# Altium schematic sheet GMSL_DESERIALIZER.SchDoc
size D; SheetNumber: 4; SheetTotal: 24
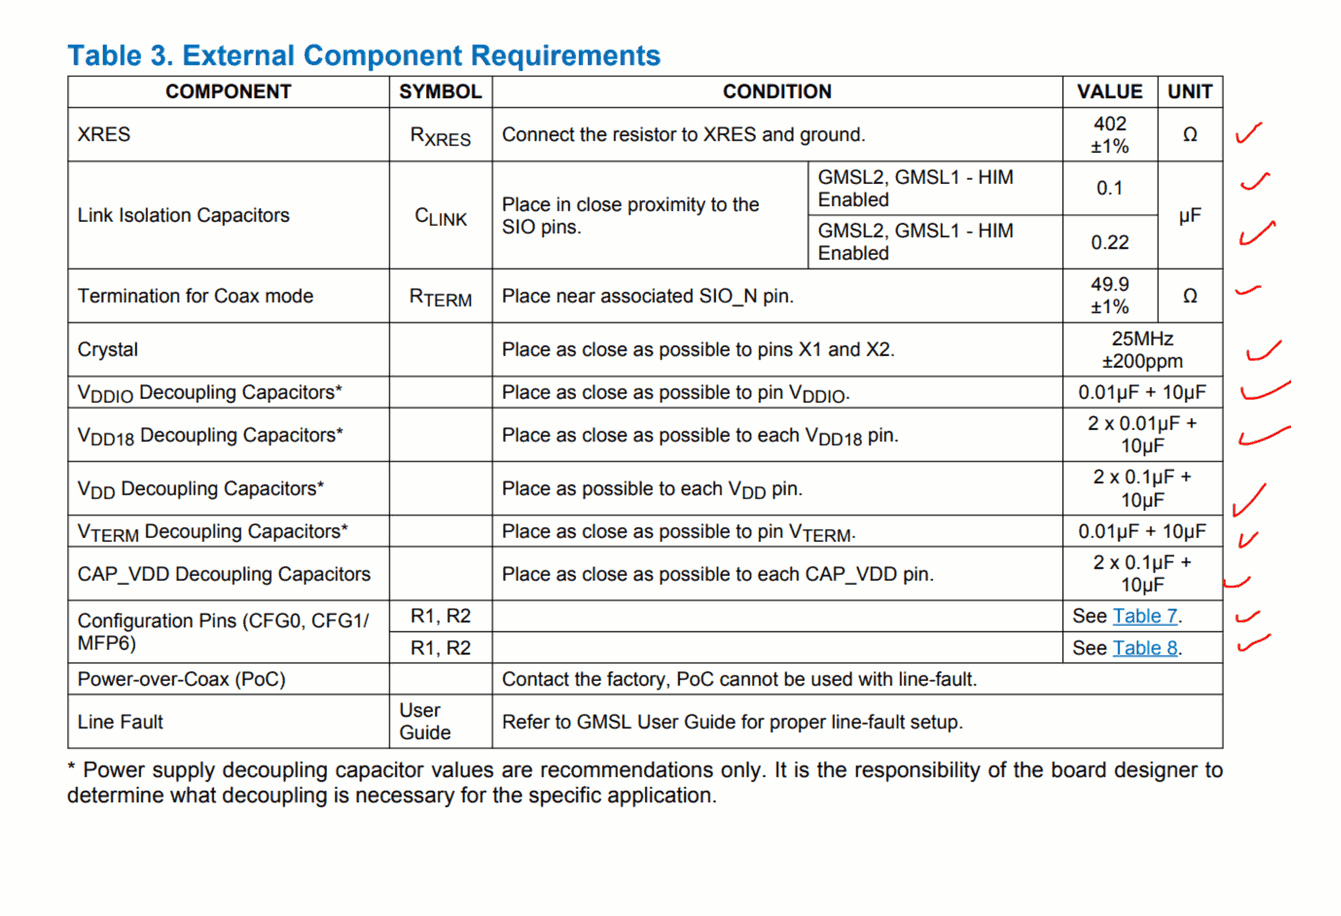
[diagram p0: GMSL_DESERIALIZER.SchDoc, top left]
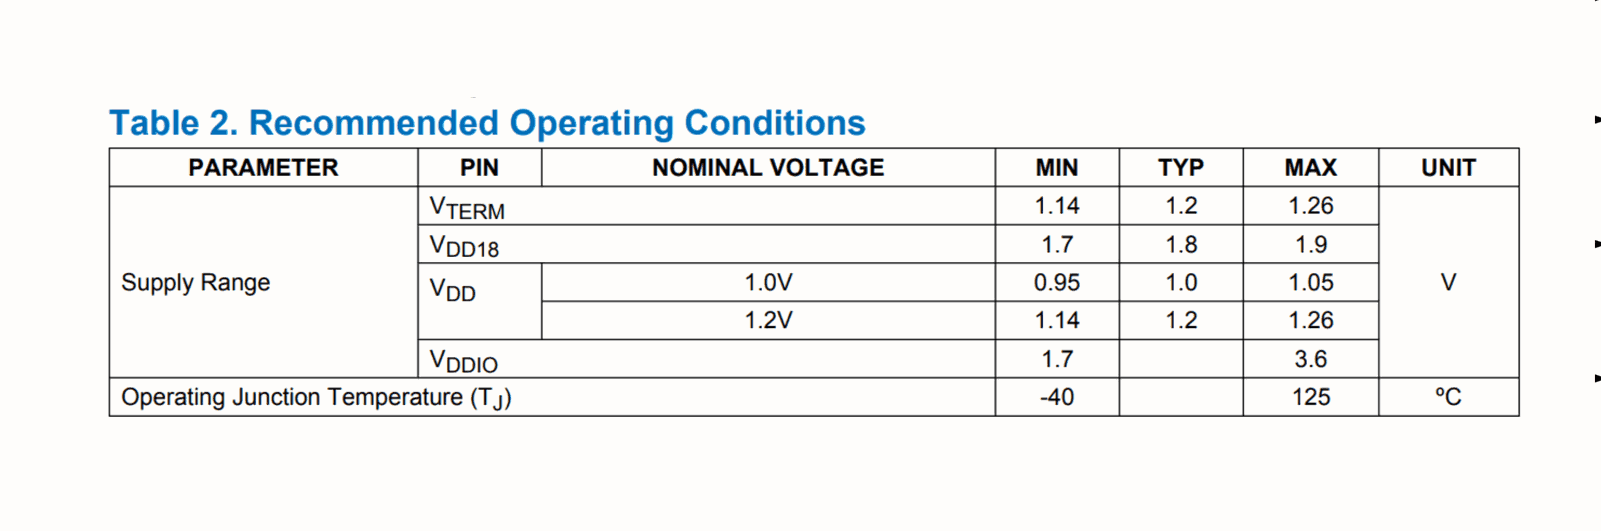
[diagram p1: GMSL_DESERIALIZER.SchDoc, top middle]
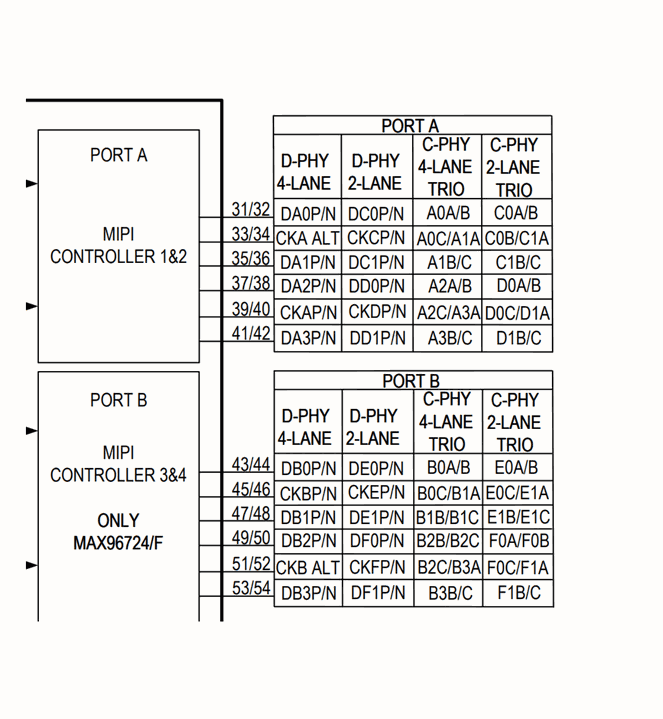
[diagram p2: GMSL_DESERIALIZER.SchDoc, top right]
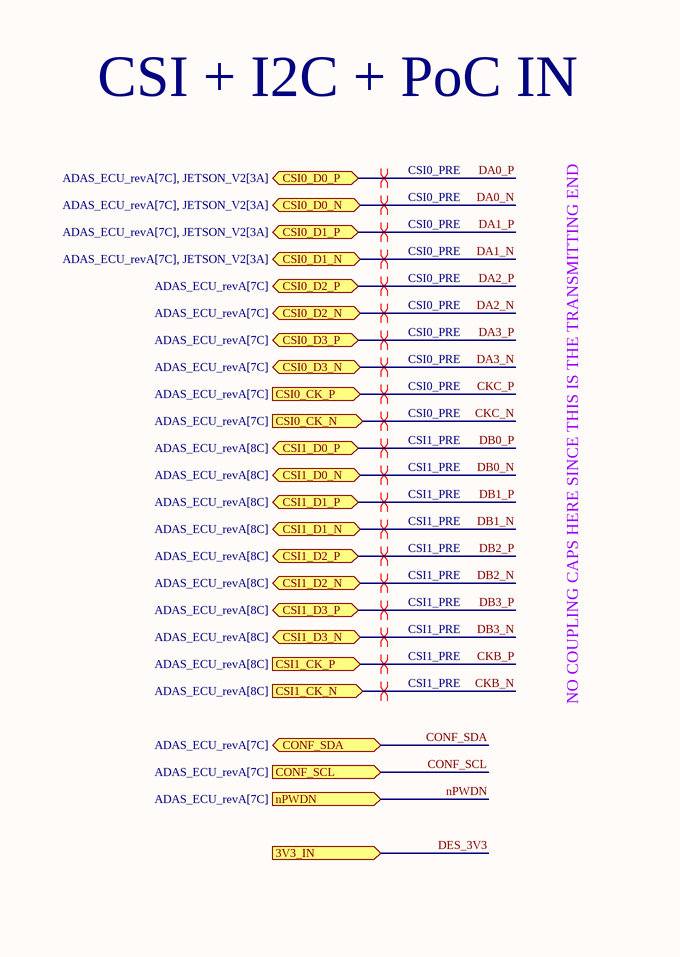
[diagram p3: GMSL_DESERIALIZER.SchDoc, centre left]
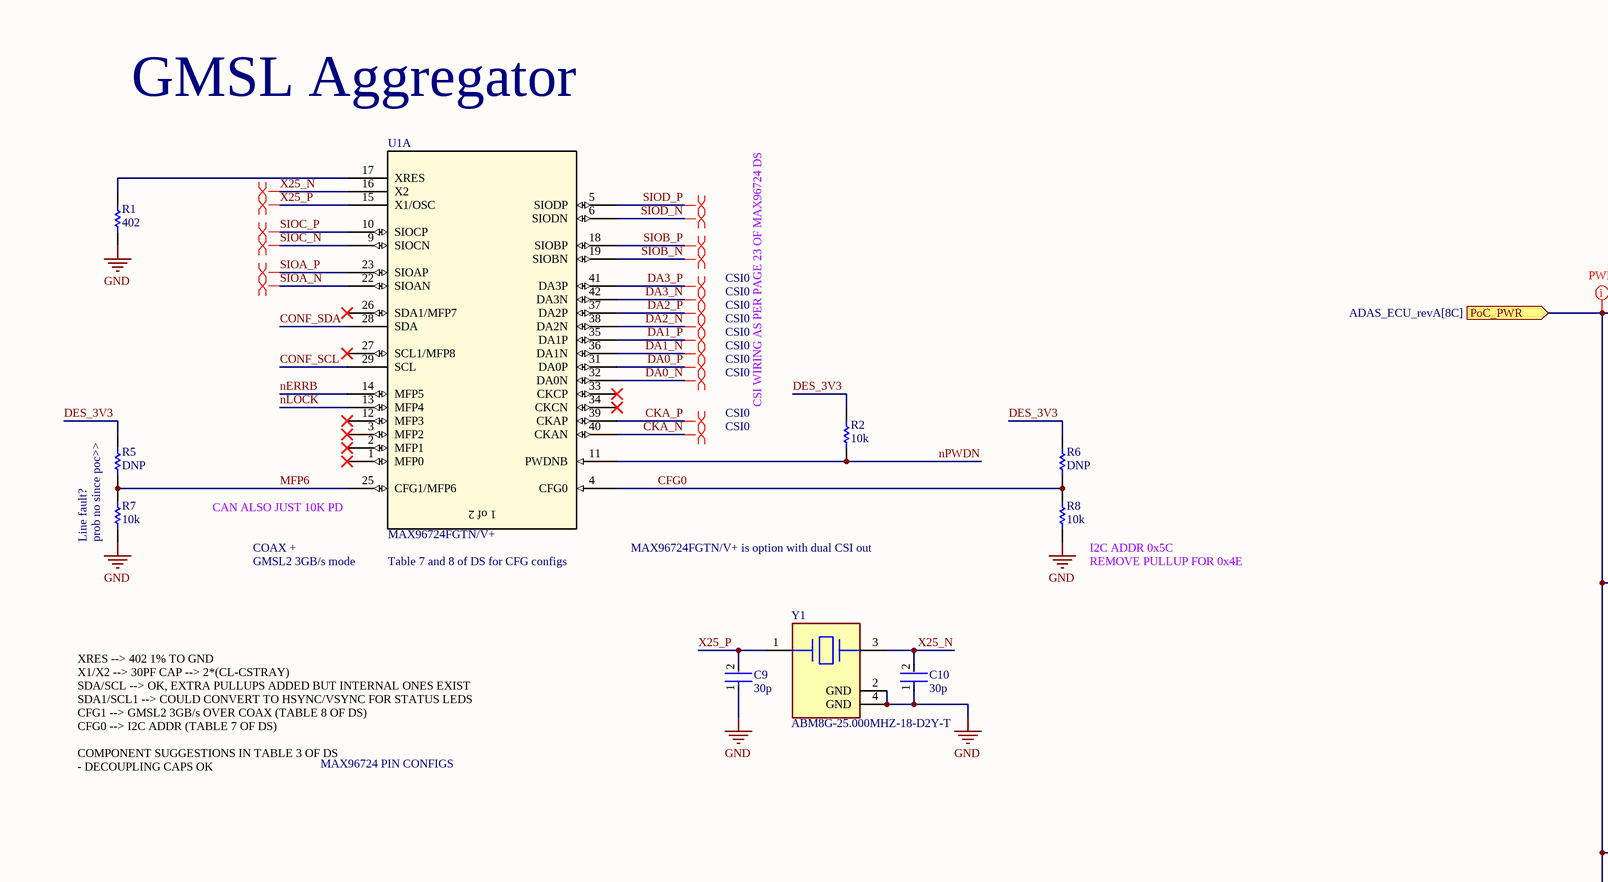
[diagram p4: GMSL_DESERIALIZER.SchDoc, centre middle]
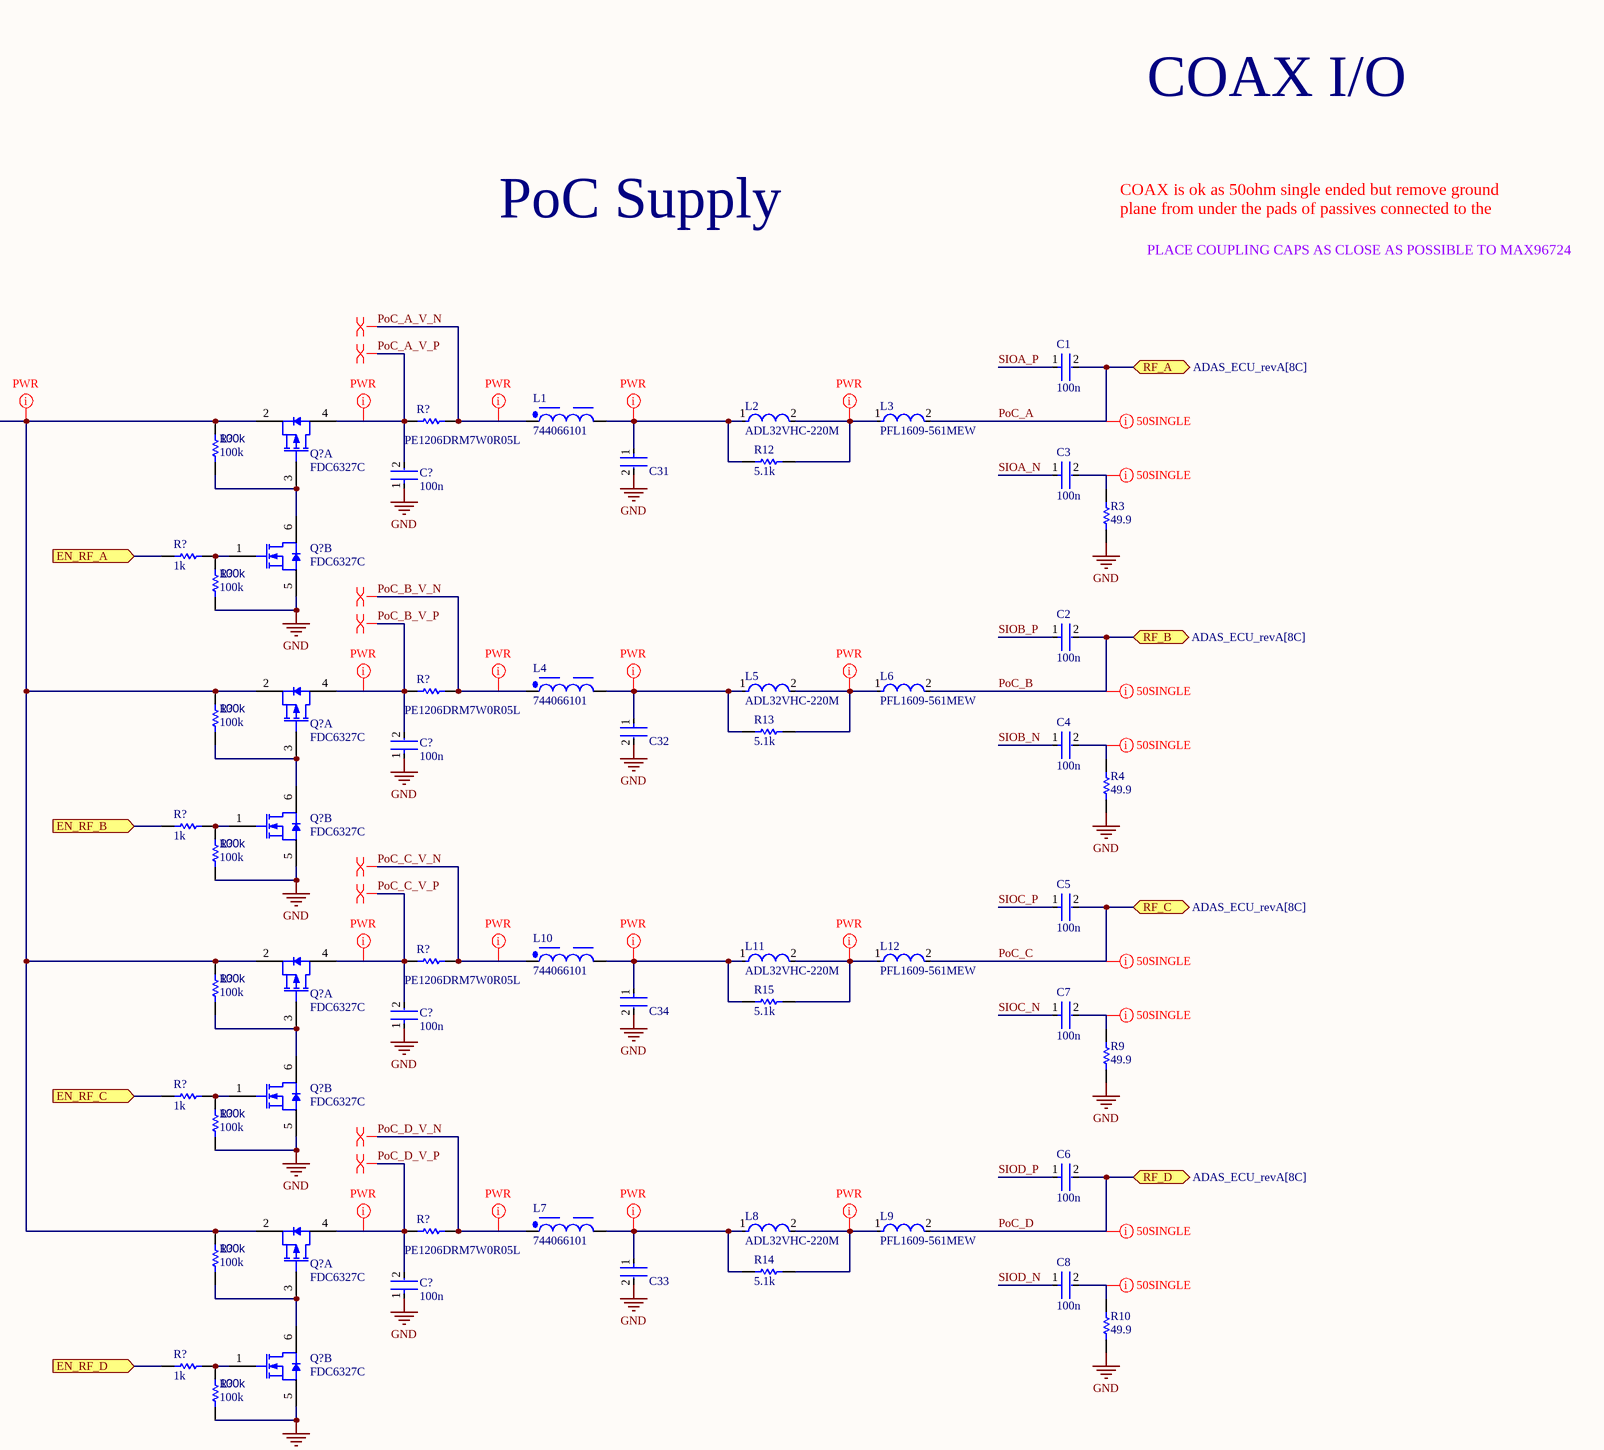
[diagram p5: GMSL_DESERIALIZER.SchDoc, centre right]
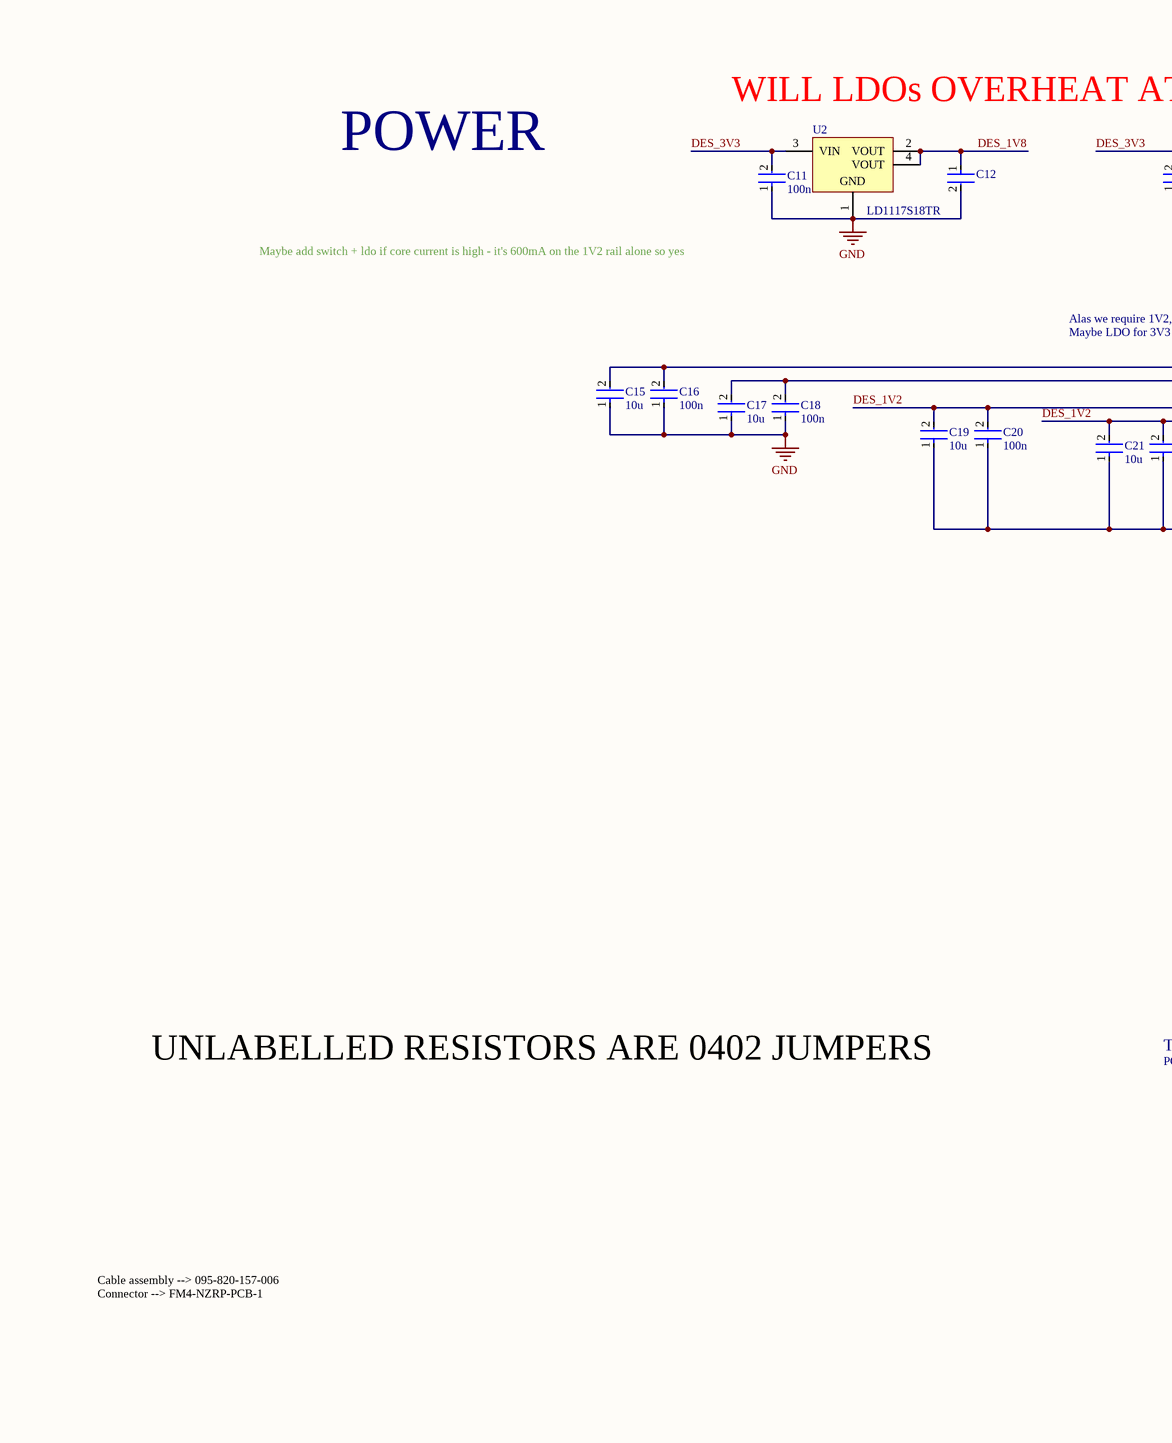
[diagram p6: GMSL_DESERIALIZER.SchDoc, bottom left]
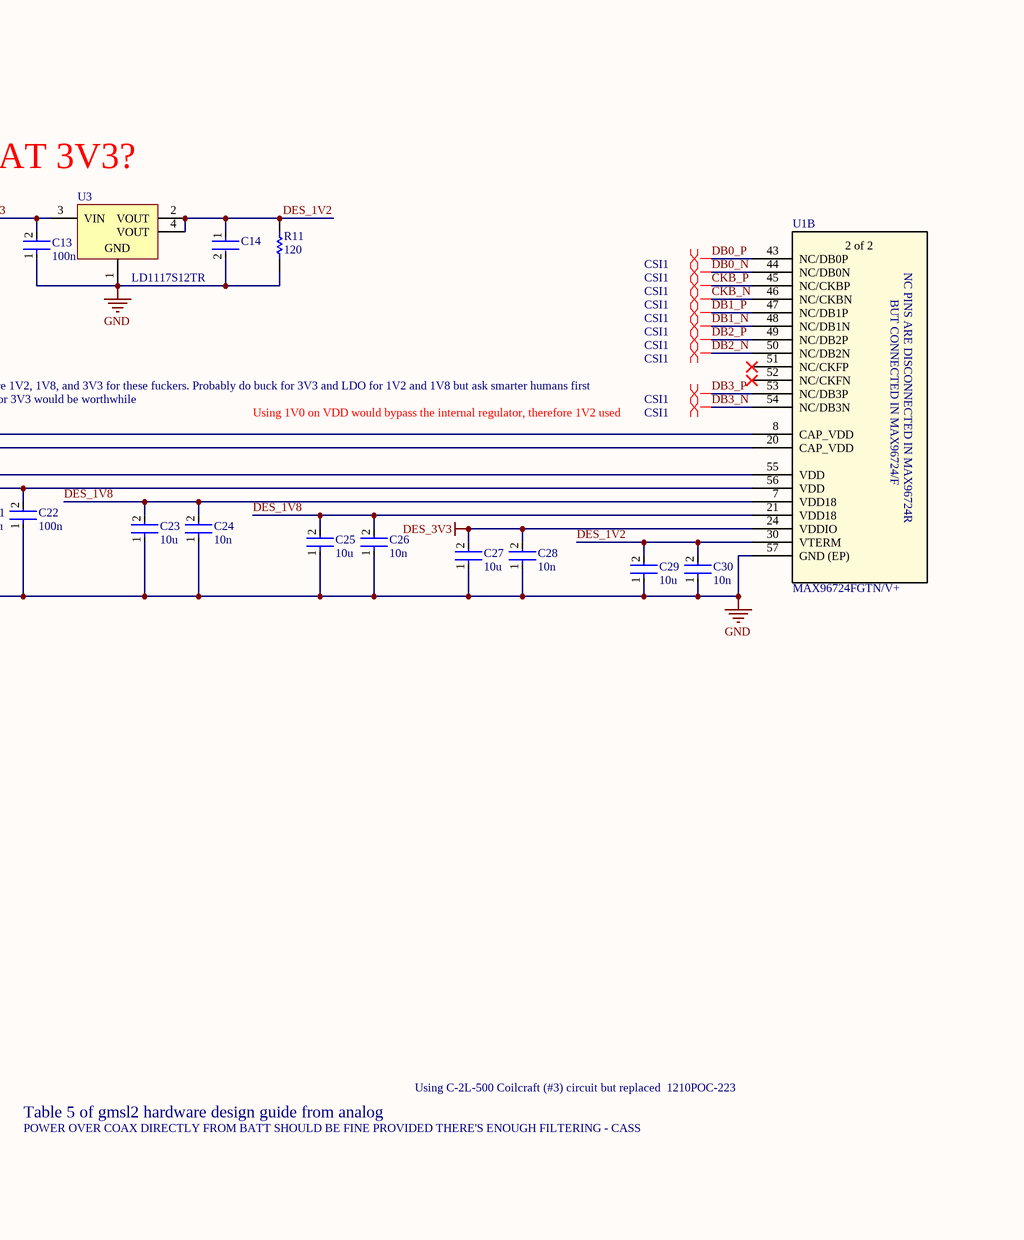
[diagram p7: GMSL_DESERIALIZER.SchDoc, bottom middle]
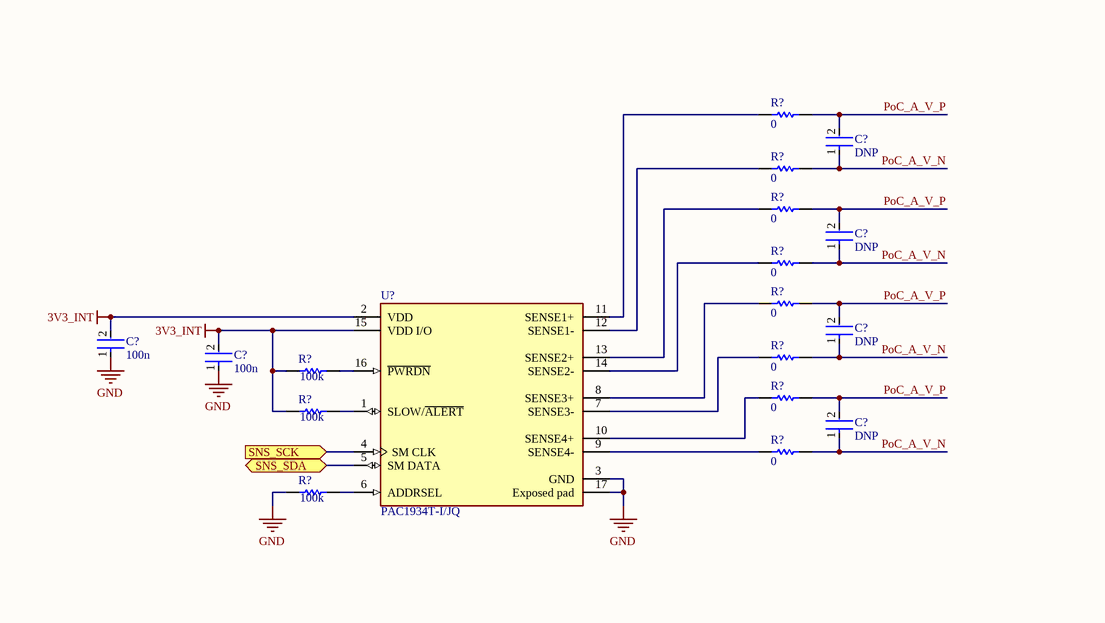
[diagram p8: GMSL_DESERIALIZER.SchDoc, bottom right]

## Parts
(Parts that share a designator on the sheet are numbered #1, #2 ... from top to bottom, then left to right.)
C1  100n  [FP-0402-L_1_0_0_05-W_0_5-IPC_A]
C2  100n  [FP-0402-L_1_0_0_05-W_0_5-IPC_A]
C3  100n  [FP-0402-L_1_0_0_05-W_0_5-IPC_A]
C4  100n  [FP-0402-L_1_0_0_05-W_0_5-IPC_A]
C5  100n  [FP-0402-L_1_0_0_05-W_0_5-IPC_A]
C6  100n  [FP-0402-L_1_0_0_05-W_0_5-IPC_A]
C7  100n  [FP-0402-L_1_0_0_05-W_0_5-IPC_A]
C8  100n  [FP-0402-L_1_0_0_05-W_0_5-IPC_A]
C9  30p  [FP-0402-L_1_0_0_05-W_0_5-IPC_A]
C10  30p  [FP-0402-L_1_0_0_05-W_0_5-IPC_A]
C11  100n  [FP-0402-L_1_0_0_05-W_0_5-IPC_A]
C12  GRM188R60J106ME47D  [FP-GRM188-0_1-e0_2_0_55-IPC_A]  (value not drawn)
C13  100n  [FP-0402-L_1_0_0_05-W_0_5-IPC_A]
C14  GRM188R60J106ME47D  [FP-GRM188-0_1-e0_2_0_55-IPC_A]  (value not drawn)
C15  10u  [FP-0402-L_1_0_0_05-W_0_5-IPC_A]
C16  100n  [FP-0402-L_1_0_0_05-W_0_5-IPC_A]
C17  10u  [FP-0402-L_1_0_0_05-W_0_5-IPC_A]
C18  100n  [FP-0402-L_1_0_0_05-W_0_5-IPC_A]
C19  10u  [FP-0402-L_1_0_0_05-W_0_5-IPC_A]
C20  100n  [FP-0402-L_1_0_0_05-W_0_5-IPC_A]
C21  10u  [FP-0402-L_1_0_0_05-W_0_5-IPC_A]
C22  100n  [FP-0402-L_1_0_0_05-W_0_5-IPC_A]
C23  10u  [FP-0402-L_1_0_0_05-W_0_5-IPC_A]
C24  10n  [FP-0402-L_1_0_0_05-W_0_5-IPC_A]
C25  10u  [FP-0402-L_1_0_0_05-W_0_5-IPC_A]
C26  10n  [FP-0402-L_1_0_0_05-W_0_5-IPC_A]
C27  10u  [FP-0402-L_1_0_0_05-W_0_5-IPC_A]
C28  10n  [FP-0402-L_1_0_0_05-W_0_5-IPC_A]
C29  10u  [FP-0402-L_1_0_0_05-W_0_5-IPC_A]
C30  10n  [FP-0402-L_1_0_0_05-W_0_5-IPC_A]
C31  GRM21BR61E226ME44L  [FP-GRM21B-0_2-e0_2_0_7-IPC_B]  (value not drawn)
C32  GRM21BR61E226ME44L  [FP-GRM21B-0_2-e0_2_0_7-IPC_B]  (value not drawn)
C33  GRM21BR61E226ME44L  [FP-GRM21B-0_2-e0_2_0_7-IPC_B]  (value not drawn)
C34  GRM21BR61E226ME44L  [FP-GRM21B-0_2-e0_2_0_7-IPC_B]  (value not drawn)
C?#1  100n  [FP-0402-L_1_0_0_05-W_0_5-IPC_A]
C?#2  100n  [FP-0402-L_1_0_0_05-W_0_5-IPC_A]
C?#3  100n  [FP-0402-L_1_0_0_05-W_0_5-IPC_A]
C?#4  100n  [FP-0402-L_1_0_0_05-W_0_5-IPC_A]
C?#5  DNP  [FP-0402-L_1_0_0_05-W_0_5-IPC_A]
C?#6  DNP  [FP-0402-L_1_0_0_05-W_0_5-IPC_A]
C?#7  DNP  [FP-0402-L_1_0_0_05-W_0_5-IPC_A]
C?#8  100n  [FP-0402-L_1_0_0_05-W_0_5-IPC_A]
C?#9  100n  [FP-0402-L_1_0_0_05-W_0_5-IPC_A]
C?#10  DNP  [FP-0402-L_1_0_0_05-W_0_5-IPC_A]
L1  744066101  [WE-TPC_1038]
L2  ADL32VHC-220M  [FP-1210POC-MFG]
L3  PFL1609-561MEW  [FP-PFL1609-MFG]
L4  744066101  [WE-TPC_1038]
L5  ADL32VHC-220M  [FP-1210POC-MFG]
L6  PFL1609-561MEW  [FP-PFL1609-MFG]
L7  744066101  [WE-TPC_1038]
L8  ADL32VHC-220M  [FP-1210POC-MFG]
L9  PFL1609-561MEW  [FP-PFL1609-MFG]
L10  744066101  [WE-TPC_1038]
L11  ADL32VHC-220M  [FP-1210POC-MFG]
L12  PFL1609-561MEW  [FP-PFL1609-MFG]
Q?#1  FDC6327C  [FAIR-SOT23-6_V]  (part A of 2)
Q?#2  FDC6327C  [FAIR-SOT23-6_V]  (part B of 2)
Q?#3  FDC6327C  [FAIR-SOT23-6_V]  (part A of 2)
Q?#4  FDC6327C  [FAIR-SOT23-6_V]  (part B of 2)
Q?#5  FDC6327C  [FAIR-SOT23-6_V]  (part A of 2)
Q?#6  FDC6327C  [FAIR-SOT23-6_V]  (part B of 2)
Q?#7  FDC6327C  [FAIR-SOT23-6_V]  (part A of 2)
Q?#8  FDC6327C  [FAIR-SOT23-6_V]  (part B of 2)
R1  402  [R0603B]
R2  10k  [R0603B]
R3  49.9  [R0603B]
R4  49.9  [R0603B]
R5  DNP  [R0603B]
R6  DNP  [R0603B]
R7  10k  [R0603B]
R8  10k  [R0603B]
R9  49.9  [R0603B]
R10  49.9  [R0603B]
R11  120  [R0603B]
R12  5.1k  [R0603B]
R13  5.1k  [R0603B]
R14  5.1k  [R0603B]
R15  5.1k  [R0603B]
R?#1  PE1206DRM7W0R05L  [R1206B]
R?#2  100k  [R0603B]
R?#3  1k  [R0603B]
R?#4  100k  [R0603B]
R?#5  PE1206DRM7W0R05L  [R1206B]
R?#6  100k  [R0603B]
R?#7  1k  [R0603B]
R?#8  100k  [R0603B]
R?#9  PE1206DRM7W0R05L  [R1206B]
R?#10  100k  [R0603B]
R?#11  1k  [R0603B]
R?#12  100k  [R0603B]
R?#13  PE1206DRM7W0R05L  [R1206B]
R?#14  100k  [R0603B]
R?#15  1k  [R0603B]
R?#16  100k  [R0603B]
R?#17  0  [R0603B]
R?#18  0  [R0603B]
R?#19  0  [R0603B]
R?#20  0  [R0603B]
R?#21  0  [R0603B]
R?#22  0  [R0603B]
R?#23  100k  [R0603B]
R?#24  0  [R0603B]
R?#25  100k  [R0603B]
R?#26  0  [R0603B]
R?#27  100k  [R0603B]
U1  MAX96724FGTN/V+  [MAX96724FGTN_V+-Footprint-1]  (parts A,B of 2)
U2  LD1117S18TR  [SOT-223_M]
U3  LD1117S12TR  [SOT-223_M]
U?  PAC1934T-I/JQ  [FP-C04-257-MFG]
Y1  ABM8G-25.000MHZ-18-D2Y-T  [FP-ABM8G-MFG]

## Ports
3V3_IN (in), CONF_SCL (in, see ADAS_ECU_revA[7C]), CONF_SDA (bidir, see ADAS_ECU_revA[7C]), CSI0_CK_N (in, see ADAS_ECU_revA[7C]), CSI0_CK_P (in, see ADAS_ECU_revA[7C]), CSI0_D0_N (bidir, see ADAS_ECU_revA[7C], JETSON_V2[3A]), CSI0_D0_P (bidir, see ADAS_ECU_revA[7C], JETSON_V2[3A]), CSI0_D1_N (bidir, see ADAS_ECU_revA[7C], JETSON_V2[3A]), CSI0_D1_P (bidir, see ADAS_ECU_revA[7C], JETSON_V2[3A]), CSI0_D2_N (bidir, see ADAS_ECU_revA[7C]), CSI0_D2_P (bidir, see ADAS_ECU_revA[7C]), CSI0_D3_N (bidir, see ADAS_ECU_revA[7C]), CSI0_D3_P (bidir, see ADAS_ECU_revA[7C]), CSI1_CK_N (in, see ADAS_ECU_revA[8C]), CSI1_CK_P (in, see ADAS_ECU_revA[8C]), CSI1_D0_N (bidir, see ADAS_ECU_revA[8C]), CSI1_D0_P (bidir, see ADAS_ECU_revA[8C]), CSI1_D1_N (bidir, see ADAS_ECU_revA[8C]), CSI1_D1_P (bidir, see ADAS_ECU_revA[8C]), CSI1_D2_N (bidir, see ADAS_ECU_revA[8C]), CSI1_D2_P (bidir, see ADAS_ECU_revA[8C]), CSI1_D3_N (bidir, see ADAS_ECU_revA[8C]), CSI1_D3_P (bidir, see ADAS_ECU_revA[8C]), EN_RF_A (in), EN_RF_B (in), EN_RF_C (in), EN_RF_D (in), nPWDN (in, see ADAS_ECU_revA[7C]), PoC_PWR (in, see ADAS_ECU_revA[8C]), RF_A (bidir, see ADAS_ECU_revA[8C]), RF_B (bidir, see ADAS_ECU_revA[8C]), RF_C (bidir, see ADAS_ECU_revA[8C]), RF_D (bidir, see ADAS_ECU_revA[8C]), SNS_SCK (in), SNS_SDA (bidir)

## Nets
3V3_INT: C?#8.2 C?#9.2 R?#23.2 R?#25.2 U?.2(VDD) U?.15(VDD_I/O)
DES_3V3: C11.2 C13.2 C27.2 C28.2 R2.2 R5.2 R6.2 U1.24(VDDIO) U2.3(VIN) U3.3(VIN) ; port 3V3_IN
GND: C9.1 C10.1 C11.1 C12.2 C13.1 C14.2 C15.1 C16.1 C17.1 C18.1 C19.1 C20.1 C21.1 C22.1 C23.1 C24.1 C25.1 C26.1 C27.1 C28.1 C29.1 C30.1 C31.2 C32.2 C33.2 C34.2 C?#1.1 C?#2.1 C?#3.1 C?#4.1 C?#8.1 C?#9.1 Q?#2.5(S) Q?#4.5(S) Q?#6.5(S) Q?#8.5(S) R1.1 R3.1 R4.1 R7.1 R8.1 R9.1 R10.1 R11.1 R?#4.1 R?#8.1 R?#12.1 R?#16.1 R?#27.2 U1.57(GND_(EP)) U2.1(GND) U3.1(GND) U?.3(GND) U?.17(Exposed_pad) Y1.2(GND) Y1.4(GND)
CFG0: R6.1 R8.2 U1.4(CFG0)
CKA_N: U1.40(CKAN)
CKA_P: U1.39(CKAP)
CKB_N: U1.46(NC/CKBN) ; port CSI1_CK_N
CKB_P: U1.45(NC/CKBP) ; port CSI1_CK_P
CKC_N: port CSI0_CK_N
CKC_P: port CSI0_CK_P
CONF_SCL: U1.29(SCL) ; port CONF_SCL
CONF_SDA: U1.28(SDA) ; port CONF_SDA
DA0_N: U1.32(DA0N) ; port CSI0_D0_N
DA0_P: U1.31(DA0P) ; port CSI0_D0_P
DA1_N: U1.36(DA1N) ; port CSI0_D1_N
DA1_P: U1.35(DA1P) ; port CSI0_D1_P
DA2_N: U1.38(DA2N) ; port CSI0_D2_N
DA2_P: U1.37(DA2P) ; port CSI0_D2_P
DA3_N: U1.42(DA3N) ; port CSI0_D3_N
DA3_P: U1.41(DA3P) ; port CSI0_D3_P
DB0_N: U1.44(NC/DB0N) ; port CSI1_D0_N
DB0_P: U1.43(NC/DB0P) ; port CSI1_D0_P
DB1_N: U1.48(NC/DB1N) ; port CSI1_D1_N
DB1_P: U1.47(NC/DB1P) ; port CSI1_D1_P
DB2_N: U1.50(NC/DB2N) ; port CSI1_D2_N
DB2_P: U1.49(NC/DB2P) ; port CSI1_D2_P
DB3_N: U1.54(NC/DB3N) ; port CSI1_D3_N
DB3_P: U1.53(NC/DB3P) ; port CSI1_D3_P
DES_1V2: C14.1 C19.2 C20.2 C21.2 C22.2 C29.2 C30.2 R11.2 U1.30(VTERM) U1.55(VDD) U1.56(VDD) U3.2(VOUT) U3.4(VOUT)
DES_1V8: C12.1 C23.2 C24.2 C25.2 C26.2 U1.7(VDD18) U1.21(VDD18) U2.2(VOUT) U2.4(VOUT)
EN_RF_A: R?#3.2 ; port EN_RF_A
EN_RF_B: R?#7.2 ; port EN_RF_B
EN_RF_C: R?#11.2 ; port EN_RF_C
EN_RF_D: R?#15.2 ; port EN_RF_D
MFP6: R5.1 R7.2 U1.25(CFG1/MFP6)
nERRB: U1.14(MFP5)
nLOCK: U1.13(MFP4)
nPWDN: R2.1 U1.11(PWDNB) ; port nPWDN
PoC_A: C1.2 L3.2 ; port RF_A
PoC_A_V_N: C?#5.1 C?#6.1 C?#7.1 C?#10.1 L1.1 R?#1.1 R?#18.1 R?#20.1 R?#22.1 R?#26.1
PoC_A_V_P: C?#1.2 C?#5.2 C?#6.2 C?#7.2 C?#10.2 Q?#1.4(D) R?#1.2 R?#17.1 R?#19.1 R?#21.1 R?#24.1
PoC_B: C2.2 L6.2 ; port RF_B
PoC_B_V_N: L4.1 R?#5.1
PoC_B_V_P: C?#2.2 Q?#3.4(D) R?#5.2
PoC_C: C5.2 L12.2 ; port RF_C
PoC_C_V_N: L10.1 R?#9.1
PoC_C_V_P: C?#3.2 Q?#5.4(D) R?#9.2
PoC_D: C6.2 L9.2 ; port RF_D
PoC_D_V_N: L7.1 R?#13.1
PoC_D_V_P: C?#4.2 Q?#7.4(D) R?#13.2
PoC_PWR: Q?#1.2(S) Q?#3.2(S) Q?#5.2(S) Q?#7.2(S) R?#2.2 R?#6.2 R?#10.2 R?#14.2 ; port PoC_PWR
SIOA_N: C3.1 U1.22(SIOAN)
SIOA_P: C1.1 U1.23(SIOAP)
SIOB_N: C4.1 U1.19(SIOBN)
SIOB_P: C2.1 U1.18(SIOBP)
SIOC_N: C7.1 U1.9(SIOCN)
SIOC_P: C5.1 U1.10(SIOCP)
SIOD_N: C8.1 U1.6(SIODN)
SIOD_P: C6.1 U1.5(SIODP)
SNS_SCK: U?.4(SM_CLK) ; port SNS_SCK
SNS_SDA: U?.5(SM_DATA) ; port SNS_SDA
X25_N: C10.2 U1.16(X2) Y1.3
X25_P: C9.2 U1.15(X1/OSC) Y1.1
NetC3_2: C3.2 R3.2
NetC4_2: C4.2 R4.2
NetC7_2: C7.2 R9.2
NetC8_2: C8.2 R10.2
NetC15_2: C15.2 C16.2 U1.8(CAP_VDD)
NetC17_2: C17.2 C18.2 U1.20(CAP_VDD)
NetC31_1: C31.1 L1.2 L2.1 R12.2
NetC32_1: C32.1 L4.2 L5.1 R13.2
NetC33_1: C33.1 L7.2 L8.1 R14.2
NetC34_1: C34.1 L10.2 L11.1 R15.2
NetL2_2: L2.2 L3.1 R12.1
NetL5_2: L5.2 L6.1 R13.1
NetL8_2: L8.2 L9.1 R14.1
NetL11_2: L11.2 L12.1 R15.1
NetQ?#1_3: Q?#1.3(G) Q?#2.6(D) R?#2.1
NetQ?#2_1: Q?#2.1(G) R?#3.1 R?#4.2
NetQ?#3_3: Q?#3.3(G) Q?#4.6(D) R?#6.1
NetQ?#4_1: Q?#4.1(G) R?#7.1 R?#8.2
NetQ?#5_3: Q?#5.3(G) Q?#6.6(D) R?#10.1
NetQ?#6_1: Q?#6.1(G) R?#11.1 R?#12.2
NetQ?#7_3: Q?#7.3(G) Q?#8.6(D) R?#14.1
NetQ?#8_1: Q?#8.1(G) R?#15.1 R?#16.2
NetR1_2: R1.2 U1.17(XRES)
NetR?#17_2: R?#17.2 U?.11(SENSE1+)
NetR?#18_2: R?#18.2 U?.12(SENSE1-)
NetR?#19_2: R?#19.2 U?.13(SENSE2+)
NetR?#20_2: R?#20.2 U?.14(SENSE2-)
NetR?#21_2: R?#21.2 U?.8(SENSE3+)
NetR?#22_2: R?#22.2 U?.7(SENSE3-)
NetR?#23_1: R?#23.1 U?.16(~{PWRDN})
NetR?#24_2: R?#24.2 U?.10(SENSE4+)
NetR?#25_1: R?#25.1 U?.1(SLOW/~{ALERT})
NetR?#26_2: R?#26.2 U?.9(SENSE4-)
NetR?#27_1: R?#27.1 U?.6(ADDRSEL)

Not connected (* = marked no-connect by the designer): U1 1(MFP0)* 2(MFP1)* 3(MFP2)* 12(MFP3)* 26(SDA1/MFP7)* 27(SCL1/MFP8)* 33(CKCP)* 34(CKCN)* 51(NC/CKFP)* 52(NC/CKFN)*

## Layout directives
differential pair; differential pair class CSI0: CKA_N, CKA_P, DA0_N, DA0_P, DA1_N, DA1_P, DA2_N, DA2_P, DA3_N, DA3_P
differential pair; differential pair class 100DIFF: SIOA_N, SIOA_P, SIOB_N, SIOB_P, SIOC_N, SIOC_P, SIOD_N, SIOD_P
differential pair: PoC_A_V_N, PoC_A_V_P, PoC_B_V_N, PoC_B_V_P, PoC_C_V_N, PoC_C_V_P, PoC_D_V_N, PoC_D_V_P, X25_N, X25_P
differential pair; differential pair class CSI1: CKB_N, CKB_P, DB0_N, DB0_P, DB1_N, DB1_P, DB2_N, DB2_P, DB3_N, DB3_P
differential pair; differential pair class CSI0_PRE: CKC_N, CKC_P, DA0_N, DA0_P, DA1_N, DA1_P, DA2_N, DA2_P, DA3_N, DA3_P
differential pair; differential pair class CSI1_PRE: CKB_N, CKB_P, DB0_N, DB0_P, DB1_N, DB1_P, DB2_N, DB2_P, DB3_N, DB3_P
net class 50SINGLE: NetC3_2, NetC4_2, NetC7_2, NetC8_2, PoC_A, PoC_B, PoC_C, PoC_D
net class PWR: NetC31_1, NetC32_1, NetC33_1, NetC34_1, NetL2_2, NetL5_2, NetL8_2, NetL11_2, PoC_A_V_N, PoC_A_V_P, PoC_B_V_N, PoC_B_V_P, PoC_C_V_N, PoC_C_V_P, PoC_D_V_N, PoC_D_V_P, PoC_PWR

## Notes on the sheet
- COAX I/O
- CSI + I2C + PoC IN
- GMSL Aggregator
- PoC Supply
- COAX is ok as 50ohm single ended but remove ground plane from under the pads of passives connected to the GMSL trace
- PLACE COUPLING CAPS AS CLOSE AS POSSIBLE TO MAX96724
- CSI WIRING AS PER PAGE 23 OF MAX96724 DS
- Line fault?
- prob no since poc>>
- CAN ALSO JUST 10K PD
- GMSL2 3GB/s mode
- COAX +
- Table 7 and 8 of DS for CFG configs
- MAX96724FGTN/V+ is option with dual CSI out
- (near R8) I2C ADDR 0x5C
- (near R8) REMOVE PULLUP FOR 0x4E
- NO COUPLING CAPS HERE SINCE THIS IS THE TRANSMITTING END
- XRES --> 402 1% TO GND
  X1/X2 --> 30PF CAP --> 2*(CL-CSTRAY)
  SDA/SCL --> OK, EXTRA PULLUPS ADDED BUT INTERNAL ONES EXIST
  SDA1/SCL1 --> COULD CONVERT TO HSYNC/VSYNC FOR STATUS LEDS
  CFG1 --> GMSL2 3GB/s OVER COAX (TABLE 8 OF DS)
  CFG0 --> I2C ADDR (TABLE 7 OF DS)
  COMPONENT SUGGESTIONS IN TABLE 3 OF DS
  - DECOUPLING CAPS OK
- MAX96724 PIN CONFIGS
- WILL LDOs OVERHEAT AT 3V3?
- POWER
- Maybe add switch + ldo if core current is high - it's 600mA on the 1V2 rail alone so yes
- Alas we require 1V2, 1V8, and 3V3 for these fuckers. Probably do buck for 3V3 and LDO for 1V2 and 1V8 but ask smarter humans first
- Maybe LDO for 3V3 would be worthwhile
- Using 1V0 on VDD would bypass the internal regulator, therefore 1V2 used
- Using C-2L-500 Coilcraft (#3) circuit but replaced  1210POC-223
- UNLABELLED RESISTORS ARE 0402 JUMPERS
- Table 5 of gmsl2 hardware design guide from analog
- POWER OVER COAX DIRECTLY FROM BATT SHOULD BE FINE PROVIDED THERE'S ENOUGH FILTERING - CASS
- Cable assembly --> 095-820-157-006
  Connector --> FM4-NZRP-PCB-1
- (in symbol CMP-015-00011-2, part A) 1 of 2
- (in symbol CMP-015-00011-2, part B) 2 of 2; NC PINS ARE DISCONNECTED IN MAX96724R; BUT CONNECTED IN MAX96724/F

## Library data of the parts
C1-C11 C13 C15-C30 C?#1-C?#10 = CMP-001-00058-1: LARGE PADS, 0402 CAP, CHANGE COMMENT TO MATCH REAL P/N; Capacitor Type: Ceramic; Min Operating Temperature: -55°C; Mounting Technology: Surface Mount; Pins: 2; Case/Package: 0402; RoHS Compliant: Yes; Max Operating Temperature: 85°C
C12 C14 = CMP-2006-02792-2: Chip Multilayer Ceramic Capacitors for General Purpose, 0603, 10uF, X5R, 15%, 20%, 6.3V; Packaging: Tape and Reel; Voltage Rating (DC): 6.3V; Width: 0.031inch; Termination: SMD/SMT; Dielectric: X5R; Package Quantity: 4000; Voltage Rating: 6.3V; Capacitance: 10uF; Case/Package: 0603; Min Operating Temperature: -55°C; Voltage: 6.3V; Length: 1.6mm; Thickness: 0.035inch; Lead Free: Lead Free; Depth: 0.8mm; Case Code (Imperial): 0603; Max Operating Temperature: 85°C; Material: Ceramic; Height: 0.8mm; Tolerance: 20%; Mount: Surface Mount; REACH SVHC: No SVHC; Radiation Hardening: No; Case Code (Metric): 1608
C31-C34 = CMP-2007-03222-3: Chip Multilayer Ceramic Capacitors for General Purpose, 0805, 22uF, X5R, 15%, 20%, 25V; Case/Package: 0805; Depth: 1.25mm; Resistor Type: Ceramic; Voltage Rating: 25V; Lead Free: Lead Free; Voltage Rating (DC): 25V; Case Code (Metric): 2012; Thickness: 0.057inch; REACH SVHC: No SVHC; Material: Ceramic; Tolerance: 20%; Length: 2mm; Capacitance: 22uF; Case Code (Imperial): 0805; Max Operating Temperature: 85°C; Termination: SMD/SMT; Weight: 0.000335oz; Dielectric: X5R; Packaging: Tape and Reel; Voltage: 25V; Package Quantity: 3000; Height: 1.25mm; Mount: Surface Mount; Width: 1.25mm; Min Operating Temperature: -55°C
L1 L4 L7 L10 = CMP-0227-00094-3: NexarPartId: 8917123; Current Rating: 1.2A; Shielding: Shielded; Core Material: Ferrite; Inductance: 100µH; Test Frequency: 100kHz; Tolerance: 30%; Resistance: 255mΩ; Self Resonant Frequency: 6MHz; Composition: Wirewound; Packaging: Cut Tape (CT); REACH SVHC: Unknown; Number of Pins: 2; Max DC Current: 1.2A; Saturation Current: 1.2A; Ambient Temperature Range High: 95°C; Weight: 1.273007g; Height: 3.8mm; Width: 10mm; Min Operating Temperature: -40°C; Max Operating Temperature: 125°C; Termination: SMD/SMT; Height - Seated (Max): 4.0894mm; Length: 10mm; RMS Current (Irms): 1.2A; Ambient Temperature Range Low: -40°C; RoHS: Compliant; Mount: Surface Mount; Depth: 10mm; DC Resistance (DCR): 255mΩ; Inductance Tolerance: 30%; Case/Package: Nonstandard
L2 L5 L8 L11 = CMP-11268-000041-1: NOT COILCRAFT - ACTUAL P# --> ADL32VHC-220M / - Power Injection Chokes for PoC; Manufacturer Part Number: 1210POC-223MRC; Value: 22uH; Core Material: Ferrite; Saturation Current: 720mA; Series Resistance: 0.88Ω; Rms Current: 700mA; Automotive Grade: Grade 1; Self Resonant Frequency: 70MHz; Test Frequency: 100kHz; Tolerance: 20%; Ambient Temperature Range High: +125°C; Manufacturer: coilcraft; Octopart: https://octopart.com/1210poc-223mrc-coilcraft-103207315; Category: Ind; Device Class L2: Inductors; RoHS: TRUE; Device Class L3: Fixed Inductors; Package: 1210POC; Ambient Temperature Range Low: -40°C; ComponentLink2URL: https://drive.google.com/open?id=15FlOq8Y4YbRFohfA_cJ40jgnqs8va2Mh; Lead Free: Yes; Inductance: 22uH; Device Class L1: Passive Components; ComponentLink2Description: Datasheet; Automotive: Yes; Height: 3mm
L3 L6 L9 L12 = CMP-11268-000007-1: Fixed Inductors PFL1609 Low Profile 0.56 uH 20 % 1.4 A; Manufacturer: coilcraft; Rms Current: 1100mA; Self Resonant Frequency: 600MHz; Core Material: Composite; Tolerance: 20%; Value: 0.56uH; Automotive Grade: Grade 1; Saturation Current: 710mA; Test Frequency: 7.9MHz; Shielding: true; Series Resistance: 130mΩ; Lead Free: Yes; Device Class L1: Passive Components; Package: PFL1609; Octopart: https://octopart.com/pfl1609-561mew-coilcraft-20329171; ComponentLink2URL: https://www.coilcraft.com/pdfs/pfl1609.pdf; Manufacturer Part Number: PFL1609-561MEW; Ambient Temperature Range Low: -40°C; Composition: Wirewound; Inductance: 0.56uH; Device Class L2: Inductors; Category: Ind; Device Class L3: Fixed Inductors; Mouser Description: Fixed Inductors PFL1609 Low Profile 0.56 uH 20 % 1.4 A; Automotive: Yes; ComponentLink2Description: Datasheet; Ambient Temperature Range High: +105°C; Height: 0.95mm; RoHS: TRUE
Q?#1-Q?#8 = CMP-2000-04939-1: Dual N & P-Channel 2.5 V Specified PowerTrench(TM) MOSFET, -55 to 150 degC, 6-Pin SOT-23, RoHS, Tape and Reel; Manufacturer: Fairchild; Typical Rise Time: 9@NChannel; Rad Hard: No; Maximum Drain Source Voltage: 20V; Typical Fall Time: 3@NChannel; Typical Turn-On Delay Time: 5@NChannel; Maximum Continuous Drain Current: 2.7@NChannel; Typical Turn-Off Delay Time: 12@NChannel; RDS-on: 80@4.5V@NChannel; Channel Mode: Enhancement; Maximum Gate Source Voltage: ±8V; Package Version: Rev. 5, 05/2015; Operating Temperature: -55to150degC; Packaging: Tape&Reel; Package Reference: SOT23-6; Package URL: https://www.fairchildsemi.com/package-drawings/MA/MA06A.pdf; Package Description: 6-Pin Small Outline Transistor, Body 2.9 x 1.6 mm, Pitch 0.95 mm; Manufacturer URL: https://www.fairchildsemi.com/; Channel Type: N; Datasheet Version: Rev. E, 07/2000; Package: 6SuperSOT; Datasheet URL: https://www.fairchildsemi.com/datasheets/FD/FDC6327C.pdf; Mounting: SurfaceMount; Category: MOSFET
R1-R15 R?#2-R?#4 R?#6-R?#8 R?#10-R?#12 R?#14-R?#27 = CMP-009-00002-14: Resistor
  R?#2 R?#4 R?#6 R?#8 R?#10 R?#12 R?#14 R?#16 R?#23 R?#25 R?#27: Value: 100k
  R?#17-R?#22 R?#24 R?#26: Value: 0
R?#1 R?#5 R?#9 R?#13 = CMP-009-00002-14: Value: 100k
U1 = CMP-015-00011-2: Quad Tunneling GMSL2/1 to CSI-2 Deserializer
U2 = CMP-0244-00308-1: Fixed Low Drop Positive Voltage Regulator, 1.8V, 4-Pin SOT-223, Tape and Reel; ComponentLink1URL: http://www.st.com; PackageReference: SOT-223; PackageDescription: 4-Pin SOT-223 Package, 6.5 x 3.5 mm Body, 2.3 mm Pitch, 7 mm Lead Span; ComponentLink2URL: http://www.st.com/internet/com/TECHNICAL_RESOURCES/TECHNICAL_LITERATURE/DATASHEET/CD00000544.pdf; ComponentLink2Description: Datasheet; ComponentLink1Description: Manufacturer URL; DatasheetVersion: 1/11/2011; PackageVersion: 2010
U3 = CMP-0244-00318-1: Fixed Low Drop Positive Voltage Regulator, 1.2V, 4-Pin SOT-223, Tape and Reel; PackageDescription: 4-Pin SOT-223 Package, 6.5 x 3.5 mm Body, 2.3 mm Pitch, 7 mm Lead Span; PackageVersion: 2010; ComponentLink2Description: Datasheet; PackageReference: SOT-223; ComponentLink2URL: http://www.st.com/internet/com/TECHNICAL_RESOURCES/TECHNICAL_LITERATURE/DATASHEET/CD00000544.pdf; ComponentLink1Description: Manufacturer URL; DatasheetVersion: 1/11/2011; ComponentLink1URL: http://www.st.com
U? = CMP-06317-000025-1: QUAD HIGH-SIDE CURRENT SENSOR; Accuracy: 1%; Min Operating Temperature: -40°C; Mount: Surface Mount; Max Operating Temperature: 85°C; Packaging: Cut Tape; RoHS Compliant: No
Y1 = CMP-2000-05733-3: Crystal 25MHz ±20ppm (Tol) ±30ppm (Stability) 18pF FUND 60Ω 4-Pin SMD T/R; Series Resistance: 60R; Length: 3.2mm; Depth: 2.5mm; Packaging: Tape and Reel; Min Operating Temperature: -40°C; Operating Frequency: 25 MHz; Lead Free: Lead Free; Number of Pins: 4; Frequency Tolerance: 20ppm; Radiation Hardening: No; Max Operating Temperature: 85°C; Termination: SMD/SMT; Frequency Stability: 30ppm; Frequency: 25MHz; Series: ABM8G; Mount: Surface Mount; Package Quantity: 1000; Height: 0.039inch; Width: 0.098inch; Case/Package: CSMD; ESR (Equivalent Series Resistance): 60R; Load Capacitance: 18pF; Tolerance: 20ppm